# EAGLE design Power Switching Circuit rev1 (EAGLE 9.6.2)
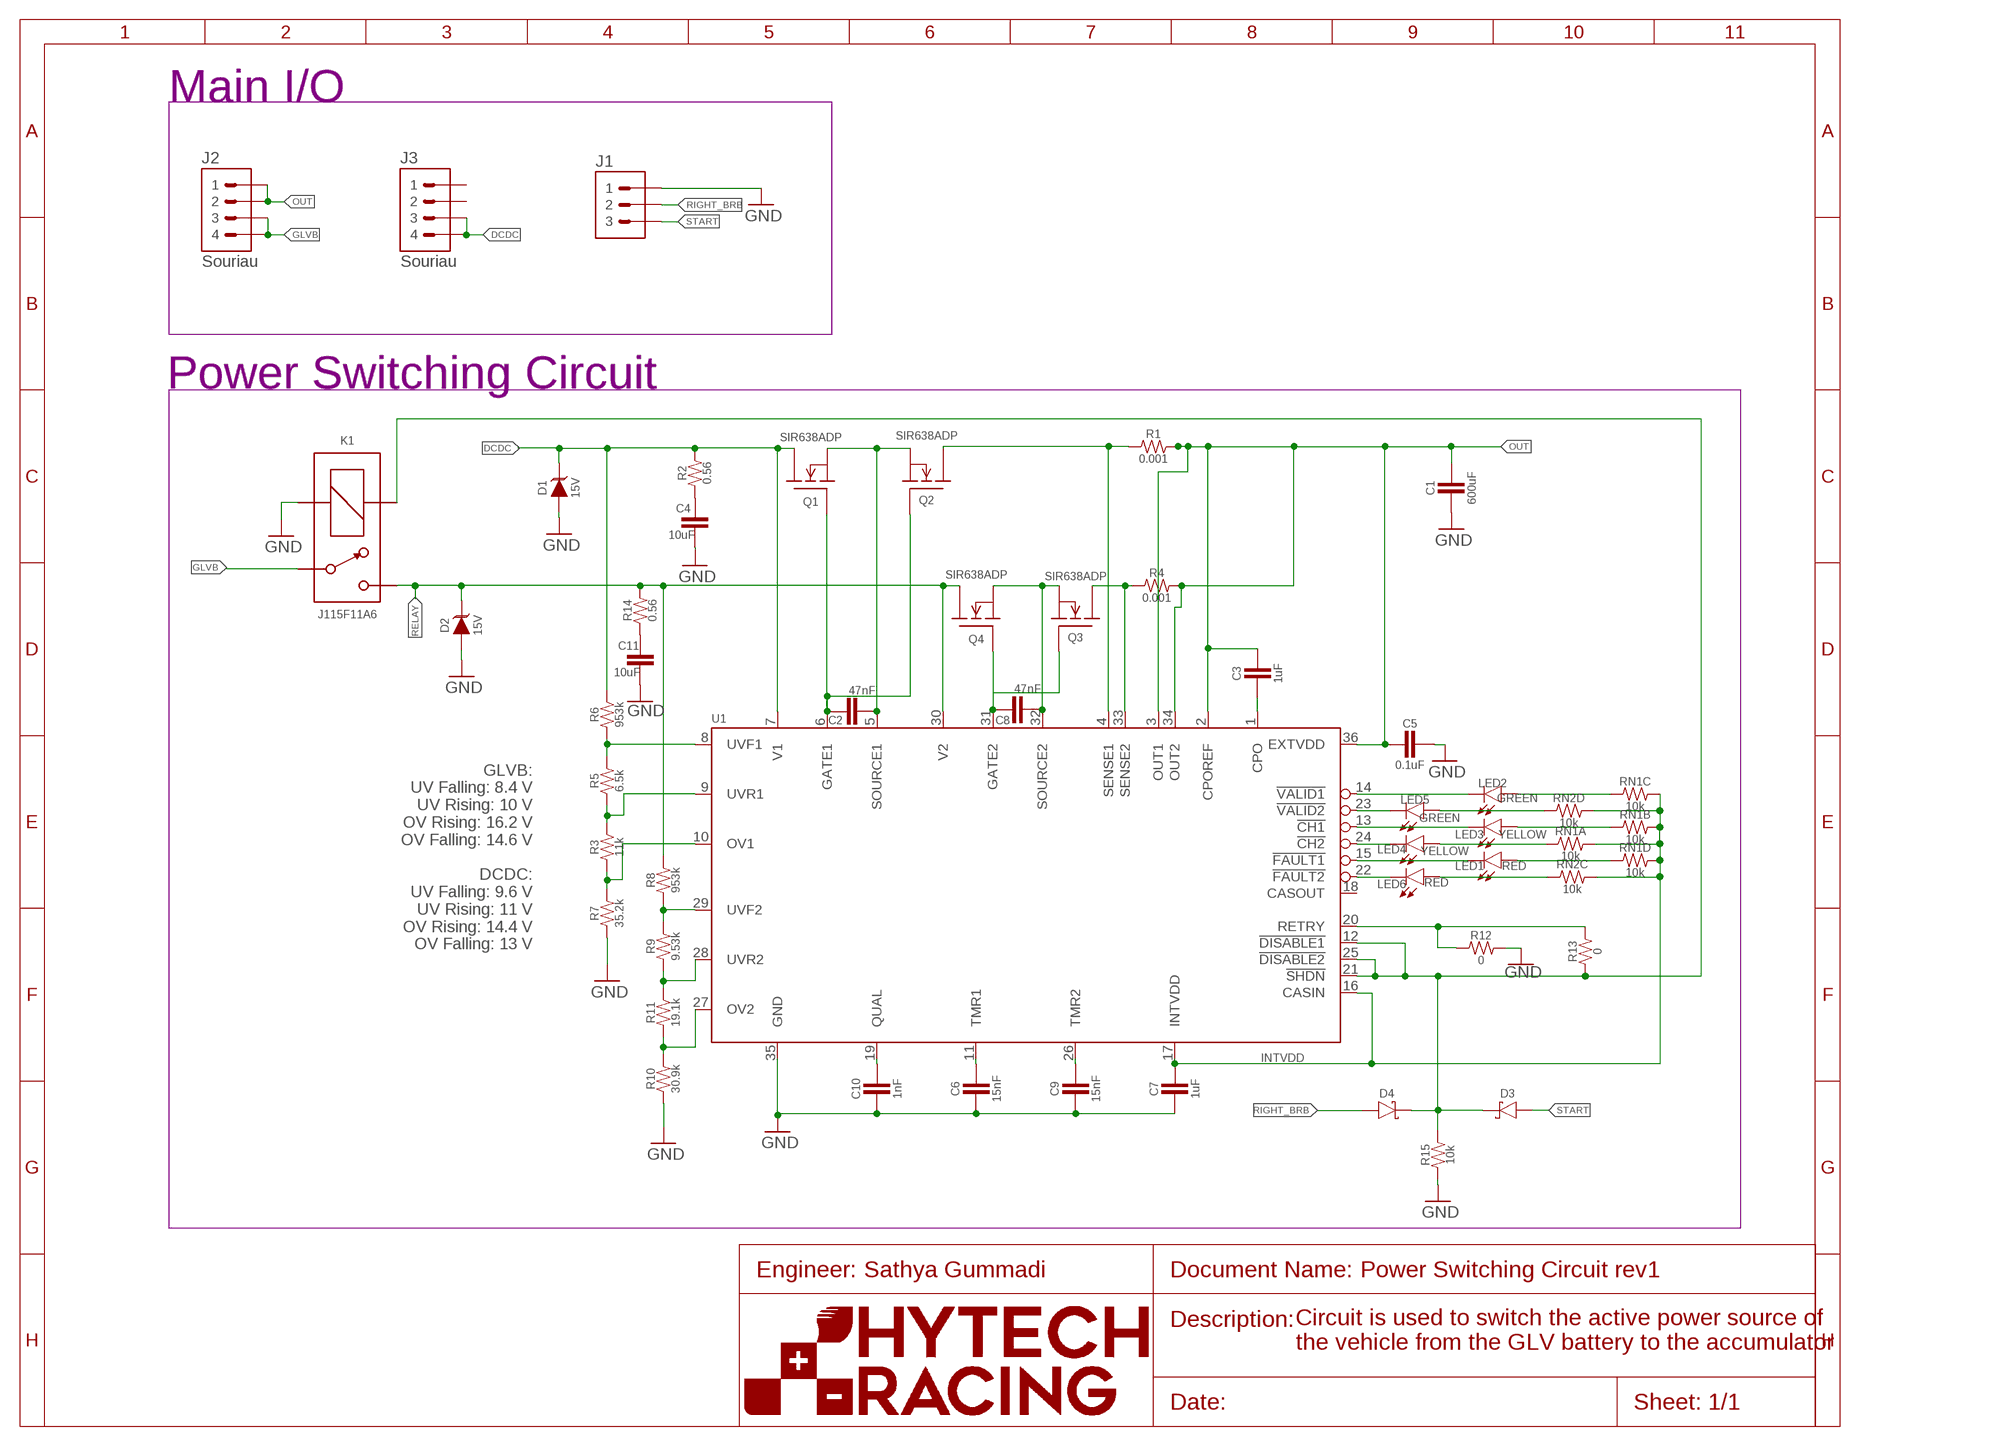
[diagram p0: schematic, sheet 1]
U$2 (FRAME_A): FRAME_DESCRIPTION: Default; ORIENTATION: LANDSCAPE; SIZE: A

## Parts
C1  600uF  CAP0603-CAP  [0603-CAP]
C2  47nF  CAP0603-CAP  [0603-CAP]
C3  1uF  CAP0603-CAP  [0603-CAP]
C4  10uF  CAP0603-CAP  [0603-CAP]
C5  0.1uF  CAP0603-CAP  [0603-CAP]
C6  15nF  CAP0603-CAP  [0603-CAP]
C7  1uF  CAP0603-CAP  [0603-CAP]
C8  47nF  CAP0603-CAP  [0603-CAP]
C9  15nF  CAP0603-CAP  [0603-CAP]
C10  1nF  CAP0603-CAP  [0603-CAP]
C11  10uF  CAP0603-CAP  [0603-CAP]
D1  TVS_15V  [SOT-23]
D2  TVS_15V  [SOT-23]
D3  SCHOTTKY  [CLP1608-2L]
D4  SCHOTTKY  [CLP1608-2L]
J1  CONNECTOR-3_  [SOURIAU_04-35]
J2  CONNECTOR-4_SOURIAU_  [SOURIAU_12-04]
J3  CONNECTOR-4_SOURIAU_  [SOURIAU_12-04]
K1  J115F11A6  [J115F11A*6*]
LED1  RED  LED-0603  [LED-603]
LED2  GREEN  LED-0603  [LED-603]
LED3  YELLOW  LED-0603  [LED-603]
LED4  YELLOW  LED-0603  [LED-603]
LED5  GREEN  LED-0603  [LED-603]
LED6  RED  LED-0603  [LED-603]
Q1  SIR638ADP  [POWERPAK_SO-8]
Q2  SIR638ADP  [POWERPAK_SO-8]
Q3  SIR638ADP  [POWERPAK_SO-8]
Q4  SIR638ADP  [POWERPAK_SO-8]
R1  0.001  RESISTOR5930-SENSE_RES  [5930-SENSE_RES]
R2  0.56  RESISTOR0805  [0805]
R3  11k  RESISTOR0603  [0603-RES]
R4  0.001  RESISTOR5930-SENSE_RES  [5930-SENSE_RES]
R5  6.5k  RESISTOR0603  [0603-RES]
R6  953k  RESISTOR0603  [0603-RES]
R7  35.2k  RESISTOR0603  [0603-RES]
R8  953k  RESISTOR0603  [0603-RES]
R9  9.53k  RESISTOR0603  [0603-RES]
R10  30.9k  RESISTOR0603  [0603-RES]
R11  19.1k  RESISTOR0603  [0603-RES]
R12  0  RESISTOR0603  [0603-RES]
R13  0  RESISTOR0603  [0603-RES]
R14  0.56  RESISTOR0805  [0805]
R15  10k  RESISTOR0603  [0603-RES]
RN1  RESISTOR_NETWORK_4_10K  [YC/TC164]
RN2  RESISTOR_NETWORK_4_10K  [YC/TC164]
U1  LTC4421  [SSOP-36]

## Nets
!CH1: LED3.C U1.13(!CH1)
!CH2: LED4.C U1.24(!CH2)
!FAULT1: LED1.C U1.15(!FAULT1)
!FAULT2: LED6.C U1.22(!FAULT2)
!SHDN!: D3.2(C) D4.2(C) K1.COIL1(COIL+) R13.1 R15.2 U1.12(!DISABLE1) U1.21(!SHDN) U1.25(!DISABLE2)
!VALID1: LED2.C U1.14(!VALID1)
!VALID2: LED5.C U1.23(!VALID2)
CPO: C3.2 U1.1(CPO)
DCDC: D1.3(C) J3.3 J3.4 Q1.D@5(D) Q1.D@6(D) Q1.D@7(D) Q1.D@8(D) Q1.D@PAD(D) R2.2 R6.2 U1.7(V1)
GATE1: C2.2 Q1.4(G) Q2.4(G) U1.6(GATE1)
GATE2: C8.2 Q3.4(G) Q4.4(G) U1.31(GATE2)
GLVB: J2.3 J2.4 K1.CONTACT1(P)
GND: C1.2 C4.2 C5.1 C6.2 C7.2 C9.2 C10.2 C11.2 D1.1(A) D2.1(A) J1.A K1.COIL2(COIL-) R7.1 R10.1 R12.2 R15.1 U1.35(GND)
INTVDD: C7.1 RN1.5 RN1.6 RN1.7 RN1.8 RN2.5 RN2.6 U1.16(CASIN) U1.17(INTVDD)
N$1: C10.1 U1.19(QUAL)
N$2: C6.1 U1.11(TMR1)
N$3: C9.1 U1.26(TMR2)
N$4: C11.1 R14.1
N$11: LED6.A RN2.3
N$13: LED1.A RN1.4
N$15: LED4.A RN1.1
N$17: LED3.A RN1.2
N$19: LED5.A RN2.4
N$21: LED2.A RN1.3
N$22: C4.1 R2.1
OUT: C1.1 C3.1 C5.2 J2.1 J2.2 R1.2 R4.2 U1.2(CPOREF) U1.3(OUT1) U1.34(OUT2) U1.36(EXTVDD)
OV1: R3.1 R7.2 U1.10(OV1)
OV2: R10.2 R11.1 U1.27(OV2)
RELAY: D2.3(C) K1.CONTACT2(S) Q4.D@5(D) Q4.D@6(D) Q4.D@7(D) Q4.D@8(D) Q4.D@PAD(D) R8.2 R14.2 U1.30(V2)
RETRY: R12.1 R13.2 U1.20(RETRY)
RIGHT_BRB: D4.1(A) J1.B
SENSE: Q2.D@5(D) Q2.D@6(D) Q2.D@7(D) Q2.D@8(D) Q2.D@PAD(D) R1.1 U1.4(SENSE1)
SENSE2: Q3.D@5(D) Q3.D@6(D) Q3.D@7(D) Q3.D@8(D) Q3.D@PAD(D) R4.1 U1.33(SENSE2)
SOURCE1: C2.1 Q1.1(S) Q1.2(S) Q1.3(S) Q2.1(S) Q2.2(S) Q2.3(S) U1.5(SOURCE1)
SOURCE2: C8.1 Q3.1(S) Q3.2(S) Q3.3(S) Q4.1(S) Q4.2(S) Q4.3(S) U1.32(SOURCE2)
START: D3.1(A) J1.C
UVF1: R5.2 R6.1 U1.8(UVF1)
UVF2: R8.1 R9.2 U1.29(UVF2)
UVR1: R3.2 R5.1 U1.9(UVR1)
UVR2: R9.1 R11.2 U1.28(UVR2)
Unconnected: J3.1 J3.2 RN2.1 RN2.2 RN2.7 RN2.8 U1.18(CASOUT)

## Notes on the sheet
- Main I/O
- Power Switching Circuit
- GLVB:
  UV Falling: 8.4 V
  UV Rising: 10 V
  OV Rising: 16.2 V
  OV Falling: 14.6 V
  
  DCDC:
  UV Falling: 9.6 V
  UV Rising: 11 V
  OV Rising: 14.4 V
  OV Falling: 13 V
- Sathya Gummadi
- Circuit is used to switch the active power source of 
  the vehicle from the GLV battery to the accumulator

## Library data of the parts
C1-C11 = HyTechDevices:CAP: Capacitor Standard 0603 ceramic capacitor, and 0.1" leaded capacitor.
D1 D2 = HyTechDevices:TVS_*: TVS Diode GSOT Datasheet <https://www.mouser.com/datasheet/2/427/gsot03-1767593.pdf>; DKPN: GSOT15-E3-08CT-ND; MANUFACTURER: Vishay General Semiconductor - Diodes Division; MOPN: 78-GSOT15-E3-08; MPN: GSOT15-E3-08; VOLTAGE: 15V
D3 D4 = HyTechDevices:SCHOTTKY: Schottky Rectifier Diode Datasheet <https://www.vishay.com/docs/85892/vsky20401608.pdf>; DKPN: 112-VSKY20401608-G4-08CT-ND; MANUFACTURER: Vishay General Semiconductor - Diodes Division; MOPN: 78-VSKY20401608G408; MPN: VSKY20401608-G4-08
J1 = HyTechDevices:CONNECTOR-3_?
J2 J3 = HyTechDevices:CONNECTOR-4_?_*; MANUFACTURER: Souriau; MODEL: Souriau; MPN: 8STA21204PN
K1 = HyTechDevices:J115F11A*6*: J11F51 No Pin 6 Normally Open Relay Datasheet <https://www.citrelay.com/Catalog%20Pages/RelayCatalog/J115F1.pdf>
LED1-LED6 = HyTechDevices:LED: Light Emitting Diode (LED) Source: Dangerous Prototypes Eagle Library <https://github.com/DangerousPrototypes/Eagle_Part_Library>
Q1-Q4 = HyTechDevices:SIR638ADP; MPN: SIR638ADP
R1-R15 = HyTechDevices:RESISTOR: Resistor Basic schematic elements and footprints for 0603, 1206, and PTH resistors.
RN1 RN2 = HyTechDevices - Copy:RESISTOR_NETWORK_4_*: Resistor Network w/ 4 Indepedent Resistors Yageo TC Series <https://www.yageo.com/upload/media/product/productsearch/datasheet/rchip/PYu-YC_TC_group_51_RoHS_L_9.pdf>; RESISTANCE: 10k
U1 = HyTechDevices:LTC4421

## Board
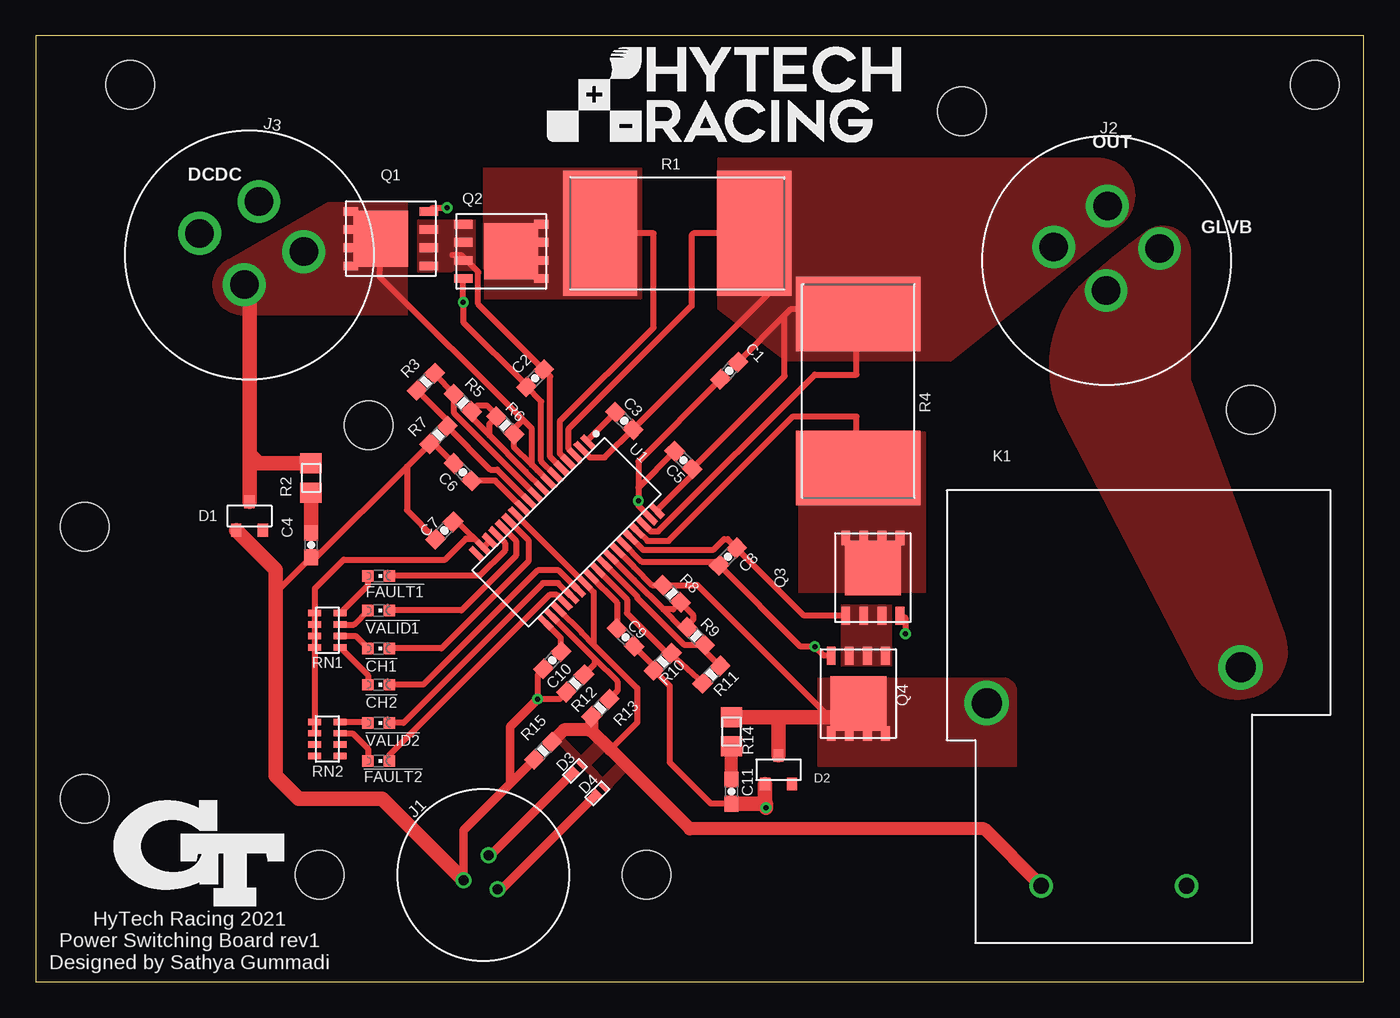
[diagram p1: board, top side]
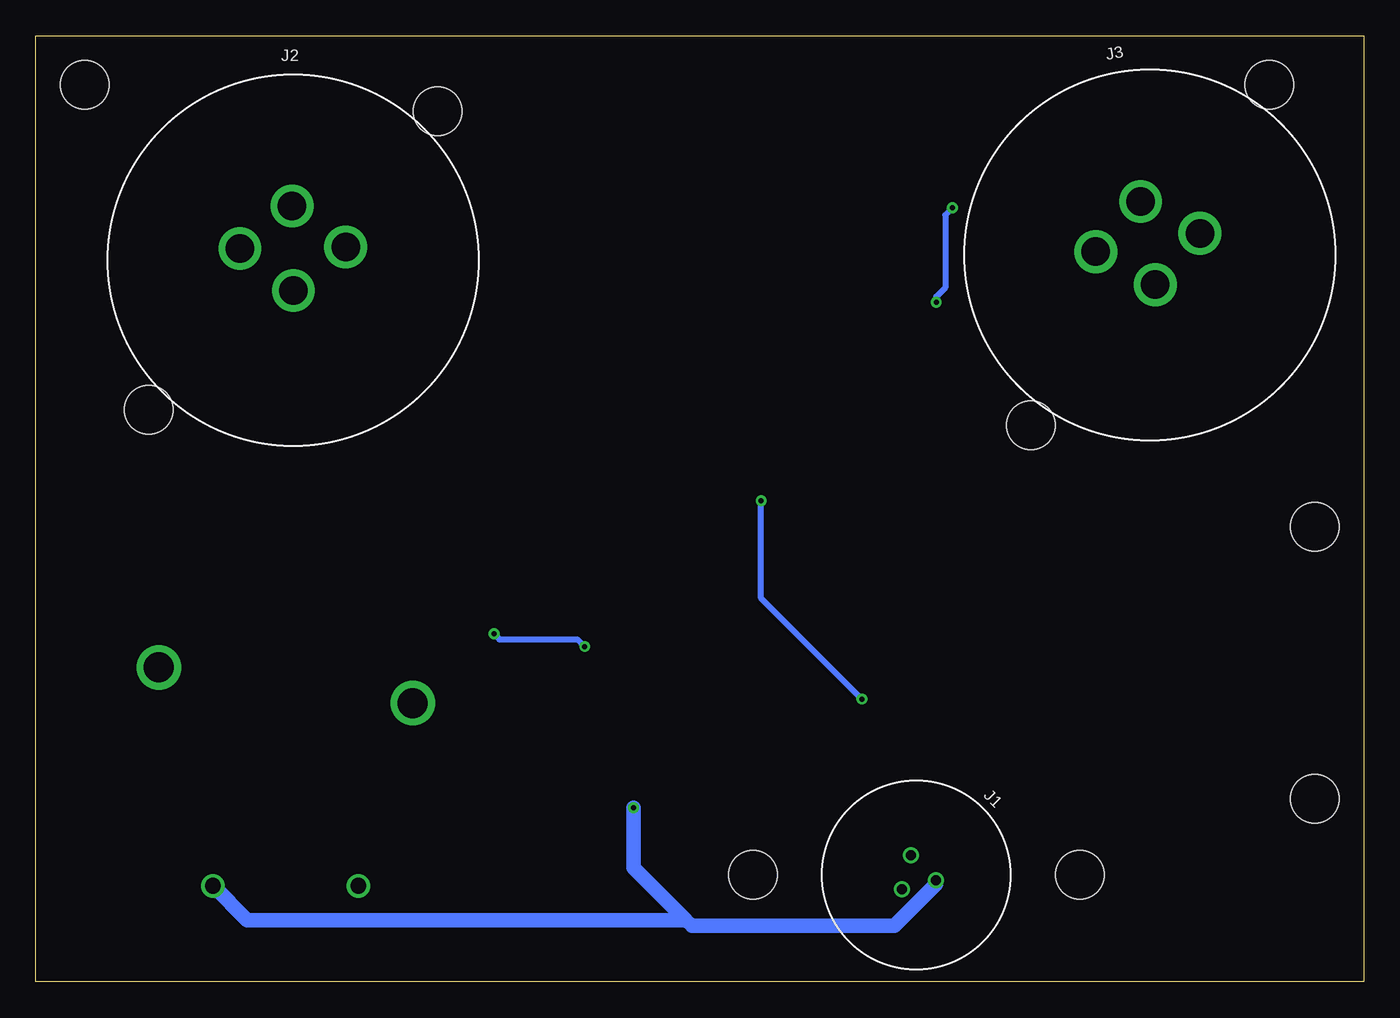
[diagram p2: board, bottom side, seen from below]

Size 93.09 x 66.29 mm. Coordinates in mm from the lower left corner, seen from the top.
Outline: 0,0 93.09,0 93.09,66.29 0,66.29 0,0
Copper layers (1*16): Top 0.035mm / dielectric 1.53mm / Bottom 0.035mm
Design rules "JLCPCB (2 Layer) - 2oz": minimum track width 8mil, minimum drill 0.3mm, track to track 8mil, track to pad 8mil, pad to pad 8mil, via to via 20mil, smd to smd 8mil, copper to edge 0.2mm, drill to drill 21mil, minimum pad ring 8mil, minimum via ring 8mil, stop-mask expansion 6mil, vias tented up to drill 30mil, thermal gap 10mil

### Footprints (pad centres in the part's own frame; a part is rotated, then mirrored left to right if it is on the bottom)
0603-CAP = smd 1.1 x 1: 1 -0.85,0; 2 0.85,0
SOT-23 = smd 0.711 x 0.889: 1 -0.94,-1.003; 2 0.94,-1.003; 3 0,1.003
CLP1608-2L = smd 0.88 x 0.62: 1 -0.295,0 | smd 0.28 x 0.62: 2 0.595,0
SOURIAU_04-35 = drill 0.7: A 1.24,0.72; B 0,-1.43; C -1.24,0.72 | hole 3.4: 8.1,8.1; -8.1,-8.1
SOURIAU_12-04 = drill 2: 1 0,3.81; 2 3.708,0.889; 3 0,-2.108; 4 -3.708,0.889 | hole 3.4: 10.288,10.288; -10.288,-10.288
J115F11A*6* = drill 1.1: COIL1 -5.989,-11.049; COIL2 4.211,-11.049 | drill 2.1: CONTACT1 8.011,4.251; CONTACT2 -9.789,1.751
LED-603 = smd 0.8 x 0.8: A 0,-0.75; C 0,0.75
POWERPAK_SO-8 = smd 1.27 x 0.61: 1 -2.667,1.905; 2 -2.667,0.635; 3 -2.667,-0.635; 4 -2.667,-1.905 | smd 1.016 x 0.61: D@5 2.794,-1.905; D@6 2.794,-0.635; D@7 2.794,0.635; D@8 2.794,1.905 | smd 3.81 x 3.912: D@PAD 0.686,0
5930-SENSE_RES = smd 5.207 x 8.738: 1 -5.397,0; 2 5.397,0
0805 = smd 1.4 x 1.5: 1 -1.025,0; 2 1.025,0
0603-RES = smd 1.1 x 1: 1 -0.85,0; 2 0.85,0
YC/TC164 = smd 0.45 x 0.9: 1 -1.2,-0.9; 2 -0.4,-0.9; 3 0.4,-0.9; 4 1.2,-0.9; 5 1.2,0.9; 6 0.4,0.9; 7 -0.4,0.9; 8 -1.2,0.9
SSOP-36 = smd 0.42 x 1.25: 1 -5.525,-3.375; 2 -4.875,-3.375; 3 -4.225,-3.375; 4 -3.575,-3.375; 5 -2.925,-3.375; 6 -2.275,-3.375; 7 -1.625,-3.375; 8 -0.975,-3.375; 9 -0.325,-3.375; 10 0.325,-3.375; 11 0.975,-3.375; 12 1.625,-3.375; 13 2.275,-3.375; 14 2.925,-3.375; 15 3.575,-3.375; 16 4.225,-3.375; 17 4.875,-3.375; 18 5.525,-3.375; 19 5.525,3.375; 20 4.875,3.375; 21 4.225,3.375; 22 3.575,3.375; 23 2.925,3.375; 24 2.275,3.375; 25 1.625,3.375; 26 0.975,3.375; 27 0.325,3.375; 28 -0.325,3.375; 29 -0.975,3.375; 30 -1.625,3.375; 31 -2.275,3.375; 32 -2.925,3.375; 33 -3.575,3.375; 34 -4.225,3.375; 35 -4.875,3.375; 36 -5.525,3.375
MOUNTING_M3 = hole 3.4: 0,0

### Placement (x,y rotation side)
C1  48.61,42.82 225 top
C2  35,42.29 225 top
C3  41.25,39.31 135 top
C4  19.3,30.61 270 top
C5  45.4,36.56 315 top
C6  6.8nF  [0603-CAP]  29.94,35.72 135 top
C7  28.64,31.62 225 top
C8  48.51,29.79 225 top
C9  6.8nF  [0603-CAP]  41.34,24.13 315 top
C10  36.21,22.54 225 top
C11  48.77,13.34 270 top
D1  14.99,32.64 0 top
D2  52.07,14.86 0 top
D3  37.8,14.78 45 top
D4  39.37,13.21 45 top
J1  31.37,7.49 315 bottom
J2  75.06,50.55 0.9 bottom
J3  14.99,50.93 10 bottom
K1  J115F11A6*  [J115F11A*6*]  76.45,17.78 0 top
LED1  24.04,28.44 270 top
LED2  24.04,26.03 270 top
LED3  24.04,23.36 270 top
LED4  24.04,20.82 270 top
LED5  24.04,18.15 270 top
LED6  24.04,15.48 270 top
Q1  24.89,52.07 180 top
Q2  32.64,51.18 0 top
Q3  58.67,28.32 90 top
Q4  57.66,20.19 270 top
R1  44.96,52.45 0 top
R2  19.3,35.31 90 top
R3  27.34,42.05 45 top
R4  57.66,41.4 90 top
R5  29.94,40.57 315 top
R6  32.91,38.99 315 top
R7  28.23,38.32 45 top
R8  44.58,27.19 135 top
R9  46.28,24.22 135 top
R10  43.95,22.43 45 top
R11  47.36,21.53 45 top
R12  37.82,20.91 225 top
R13  39.58,19.19 45 top
R14  48.77,17.53 90 top
R15  35.56,16.19 45 top
RN1  20.45,24.64 90 top
RN2  20.45,17.02 90 top
U1  37.21,31.5 225 top
U$1  [MOUNTING_M3]  3.43,12.83 0 top
U$3  [MOUNTING_M3]  3.43,31.88 0 top
U$4  [MOUNTING_M3]  89.66,62.86 0 top
U$5  [LOGO_GT_0.50"]  11.43,9.02 0 top
U$6  [LOGO_HYTECH_1.0"]  35.56,58.55 0 top

### Tracks (layer width: path | path; a pad name or v marks a point on that pad's centre or on a via)
!CH1
  Top 0.406: U1.13 34.54,30.95 34.54,29.46 28.44,23.36 LED3.C
!CH2
  Top 0.406: U1.24 36.66,28.83 35.18,28.83 27.17,20.82 LED4.C
!FAULT1
  Top 0.406: LED1.C 31.11,28.44 32.89,30.21 32.89,30.76 U1.15
!FAULT2
  Top 0.406: U1.22 36.53,27.12 36.01,27.12 24.79,15.9 LED6.C
!SHDN!
  Top 0.406: U1.12 U1.25 39.11,27.3 39.11,23.63 | 40.29,16.28 42.16,18.16 42.16,20.57 39.11,23.63 | 38.29,24.45 38.28,24.45 | 38.29,24.45 39.11,23.63 | 38.29,24.45 38.28,24.45 | U1.21 38.28,24.45 | R15.2 36.48,16.79 36.45,17.07
  Top 0.914: K1.COIL1 66.48,10.72 45.85,10.72 40.29,16.28 38.98,17.59 38.98,17.91 | R13.1 38.98,17.91 | 38.98,17.91 38.72,17.65 37.03,17.65 36.45,17.07
  pour Top (no thermals): 40.03,13.28 36.09,17.27 36.46,17.64 40.38,13.64
  pour Top (no thermals): 38.24,15.84 39.28,16.88 39.93,16.23 38.89,15.16
  pour Top (no thermals): 40.36,13.67 41.73,15.06 41.15,15.7 39.74,14.29
!VALID1
  Top 0.406: U1.14 33.66,30.91 33.66,29.84 29.84,26.03 LED2.C
!VALID2
  Top 0.406: U1.23 36.63,27.94 35.56,27.94 25.77,18.15 LED5.C
CPO
  Top 0.406: U1.1 38.73,37.99 C3.2
DCDC
  Top 0.406: U1.7 35.17,35.84 | 35.17,35.84 34.79,36.22 | 35.17,35.84 34.79,36.22 | 34.79,36.22 33.51,37.5 R6.2 33.51,38.72 34.16,39.37 | 34.79,36.22 34.79,38.75 34.16,39.37 | Q1.D@PAD 24.08,49.45 34.16,39.37
  Top 1.016: R2.2 15.61,36.33 14.99,36.96 | 14.99,36.96 D1.3 | J3.3 14.99,48.48 14.99,36.96
  pour Top (no thermals): 13.67,50.71 20.47,54.64 26.04,54.64 26.04,46.71 14.53,46.71 arc-156
GATE1  (via drill 0.35)
  Top 0.406: U1.6 35.43,36.49 35.43,40.66 C2.2 34.4,41.8 29.97,46.23 v29.97,47.62 Q2.4 | Q1.4 27.81,54.23 v28.83,54.23
  Bottom 0.406: v28.83,54.23 29.34,53.72 29.34,48.64 29.97,48.01 v29.97,47.62
GATE2  (via drill 0.35)
  Top 0.406: Q3.4 60.96,25.53 v60.96,24.38 | C8.2 53.61,23.5 v54.61,23.5 55.25,22.86 Q4.4 | C8.2 47.66,29.45 42.48,29.45 U1.31 | C8.2
  Bottom 0.406: v60.96,24.38 60.58,24 55.12,24 v54.61,23.5
GLVB
  pour Top (no thermals): 77.82,52.53 arc-133 80.9,50.9 80.9,42.18 87.47,24.4 arc-177 81.12,21.87 72.06,39.28 arc-80 74.36,49.8 arc-4
GND  (via drill 0.35)
  Top 0.406: C9.2 43.34,22.13 R10.1 44.45,20.72 44.45,15.37 47.33,12.49 C11.2 | C6.2 27.93,37.72 R7.1 26.02,36.11 | C7.2 26.02,33.05 26.02,36.11 | C1.2 42.24,36.45 42.24,34.62 | 42.24,34.62 v42.24,33.71 42.24,33.36 U1.35 | R12.2 36.72,19.81 v35.18,19.81 35.18,21.51 C10.2 | 26.02,36.11 19.67,29.76 C4.2 16.82,27.27 16.82,26.8 | C5.1 44.78,37.16 42.24,34.62
  Top 0.61: R15.1 33.25,13.87 | 33.25,13.87 29.98,10.61 J1.A | v35.18,19.81 33.25,17.88 33.25,13.87
  Top 1.016: v51.18,12.19 51.18,12.45 51.14,12.49 | D2.1 51.13,12.5 51.14,12.49 | C11.2 51.14,12.49 | D1.1 16.82,28.87 16.82,26.8 16.82,14.43 18.41,12.83 24.28,12.83 J1.A
  Bottom 0.406: v42.24,33.71 42.24,26.88 v35.18,19.81
  Bottom 1.016: v51.18,12.19 51.18,8 47.5,4.32 | K1.COIL2 78.25,4.32 47.5,4.32 | 47.5,4.32 47.1,3.92 32.91,3.92 29.98,6.85 J1.A
INTVDD
  Top 0.406: U1.17 U1.16 | 29.72,32.1 29.37,32.1 29.72,32.1 | U1.17 31.35,30.44 30.74,31.05 30.16,31.05 28.7,29.59 21.59,29.59 19.56,27.56 19.56,25.85 RN1.5 RN1.6 RN1.7 RN1.8 RN2.5 RN2.6 | U1.17 29.72,32.1 | C7.1 29.59,32.22 29.72,32.1
N$1
  Top 0.406: C10.1 36.81,24.09 U1.19
N$2
  Top 0.406: U1.11 32.21,35.12 C6.1
N$3
  Top 0.406: U1.26 40.74,26.59 C9.1
N$4
  Top 0.914: C11.1 R14.1
N$11
  Top 0.406: RN2.3 22.21,17.42 23.29,16.33 LED6.A
N$13
  Top 0.406: RN1.4 23.29,27.78 LED1.A
N$15
  Top 0.406: RN1.1 23.29,21.49 LED4.A
N$17
  Top 0.406: RN1.2 22.41,24.24 LED3.A
N$19
  Top 0.406: RN2.4 23.23,18.22 LED5.A
N$21
  Top 0.406: RN1.3 22.3,25.04 LED2.A
N$22
  Top 1.016: C4.1 R2.1
OUT
  Top 0.406: U1.2 38.85,36.74 39.89,36.74 C3.1 52.07,48.92 52.07,49.66 | 48.89,53.09 50.29,53.09 | U1.3 37.36,37.32 37.36,38.76 45.97,47.37 45.97,52.32 46.1,52.45 R1.2 | C1.1 52.49,46.7 | 52.49,46.7 52.91,47.12 53.34,47.12 | U1.34 43.12,31.56 43.62,31.56 54.61,42.55 57.53,42.55 57.53,44.7 | 52.49,46.7 52.49,42.45 C5.2 46,35.51 U1.36
  pour Top (no thermals): 47.83,57.66 47.83,47.18 52.58,43.56 64.15,43.56 76.07,53.12 arc137 74.67,57.66
OV1
  Top 0.406: U1.10 32.35,35.9 31.86,35.9 R7.2 28.83,39.36 R3.1
OV2
  Top 0.406: R10.2 44.55,22.96 | 44.55,22.96 R11.1 | U1.27 41.43,26.82 41.43,25.84 44.31,22.96 44.55,22.96
RELAY
  Top 0.406: U1.30 41.93,29.07 43.21,27.79 R8.2 46.38,27.79 55.25,18.92 | 55.88,18.55 57.15,18.55
  Top 1.016: 52.07,18.55 55.88,18.55 | 57.15,18.55 57.78,18.55 | D2.3 52.07,18.55 | R14.2 52.07,18.55
  pour Top (no thermals): 54.86,21.29 67.75,21.29 arc-82 68.71,20.45 68.71,15.11 54.86,15.11
RETRY
  Top 0.406: U1.20 37.75,24.06 39.1,22.71 39.16,22.65 | R12.1 39.16,22.26 39.16,22.65 | R13.2 40.77,20.38 40.77,21.05 39.16,22.65
RIGHT_BRB
  Top 0.61: D4.1 32.64,6.48 J1.B
SENSE
  Top 0.406: 41.15,52.45 43.31,52.45 43.31,45.85 36.73,39.27 36.73,37.03 U1.4
  pour Top (no thermals): 42.42,57.02 42.42,47.88 31.42,47.88 31.42,57.02
SENSE2
  Top 0.406: U1.33 42.87,30.9 44.36,30.9 53.09,39.62 57.53,39.62 57.53,36.13 R4.1
  pour Top (no thermals): 53.49,38.48 53.49,27.33 62.36,27.33 62.36,38.48
SOURCE1
  Top 0.406: U1.5 36.07,36.78 36.07,42.43 C2.1 31.01,47.48 31.01,49.66 31.01,49.75 29.84,50.93 29.21,50.93
  pour Top (no thermals): 26.77,53.34 26.77,49.78 30.81,49.78 30.81,53.34
SOURCE2
  Top 0.406: U1.32 42.58,30.27 47.5,30.28 47.52,30.28 48.26,31.01 48.5,31.01 C8.1 | 48.99,30.27 C8.1 | Q3.1 53.86,25.65 C8.1
  pour Top (no thermals): 56.44,22.15 59.89,22.15 60.02,22.15 60.02,26.31 60.02,26.39 56.44,26.39 56.44,26.34
START
  Top 0.61: D3.1 31.89,8.88 J1.C
UVF1
  Top 0.406: U1.8 34.34,35.74 31.8,38.28 | 31.8,38.28 30.54,39.55 R5.2 30.96,40.39 31.62,40.39 32.31,39.7 R6.1 31.8,39.09 31.8,38.28
UVF2
  Top 0.406: U1.29 41.94,28.14 44,26.09 | 44,26.09 45.26,24.82 R9.2 45.68,24.98 46.1,25.4 46.1,25.67 R8.1 44.68,26.09 44,26.09
UVR1
  Top 0.406: R3.2 27.95,42.56 R5.1 29.34,39.83 U1.9 | R3.2
UVR2
  Top 0.406: U1.28 42.15,27.02 42.15,26.91 45.44,23.62 R9.1 46.88,23.21 R11.2

### Text on the board
tPlace: OUT | DCDC | GLVB | !FAULT1 | !VALID1 | !CH1 | !CH2 | !VALID2 | !FAULT2 | HyTech Racing 2021 / Power Switching Board rev1 / Designed by Sathya Gummadi